# Altium schematic sheet Control_Test_Board.SchDoc: Control Test Board - Logic
size A4; Author: Dev Patel; Organization: Waterloop; Address1: 200 University Ave W; Address2: Engineering 5, 1104; Address3: Waterloo, ON; Address4: N2L 3G1; Revision: 1.0; SheetNumber: 1; SheetTotal: 2
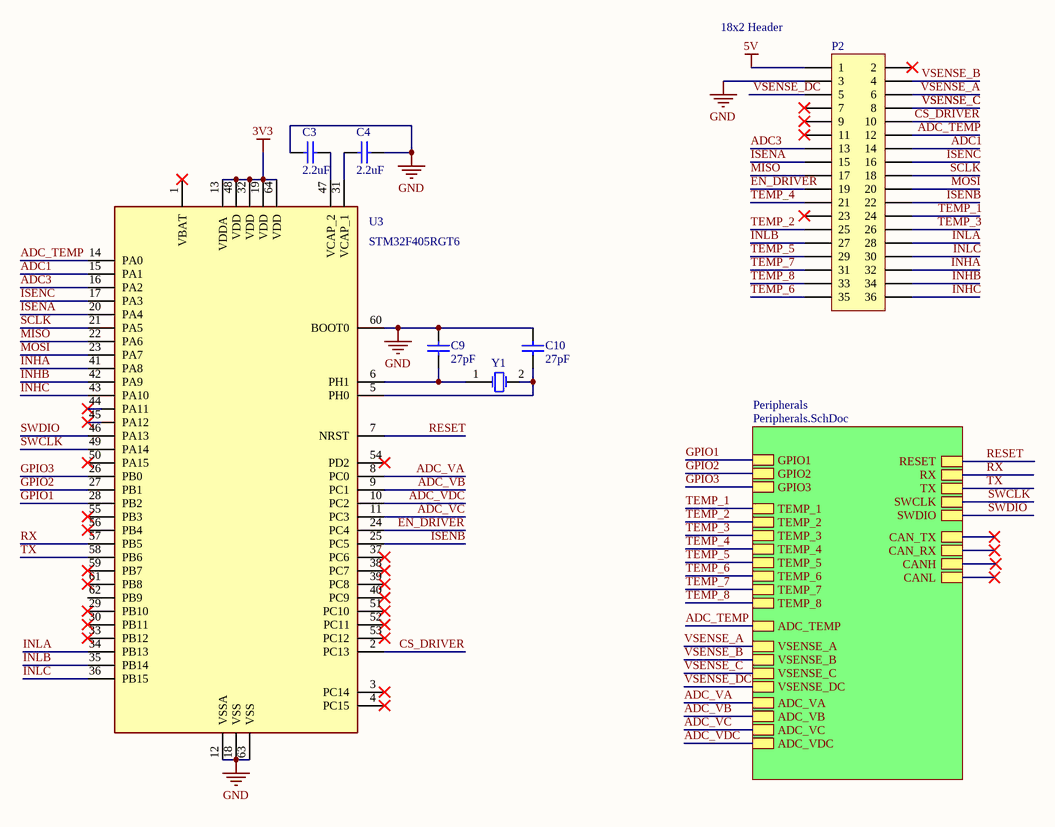
[diagram p0: Control_Test_Board.SchDoc]

## Parts
C3  value 2.2uF  [0805 - Capacitor]  (hidden comment: Capacitor - Nonpolarized)
C4  value 2.2uF  [0805 - Capacitor]  (hidden comment: Capacitor - Nonpolarized)
C9  value 27pF  [0805 - Capacitor]  (hidden comment: 100V)
C10  value 27pF  [0805 - Capacitor]  (hidden comment: 100V)
P2  Header 18X2  [HDR2X18]  (value not drawn)
U3  STM32F405RGT6  [STM32F405RG]
Y1  Oscillator  [2-SMD NO LEAD CRSYSTAL]  (value not drawn)

## Sub-sheets
Peripherals = Peripherals.SchDoc: GPIO1, GPIO2, GPIO3, TEMP_1, TEMP_2, TEMP_3, TEMP_4, TEMP_5, TEMP_6, TEMP_7, TEMP_8, ADC_TEMP, VSENSE_A, VSENSE_B, VSENSE_C, VSENSE_DC, ADC_VA, ADC_VB, ADC_VC, ADC_VDC, RESET, RX, TX, SWCLK, SWDIO, CAN_TX, CAN_RX, CANH, CANL

## Nets
3V3: U3.13(VDDA) U3.19(VDD) U3.32(VDD) U3.48(VDD) U3.64(VDD)
5V: P2.1
GND: C3.1 C4.2 C9.2 C10.2 P2.3 U3.12(VSSA) U3.18(VSS) U3.60(BOOT0) U3.63(VSS)
ADC1: P2.14 U3.15(PA1)
ADC3: P2.13 U3.16(PA2)
ADC_TEMP: P2.12 U3.14(PA0) ; sheet Peripherals/ADC_TEMP
ADC_VA: U3.8(PC0) ; sheet Peripherals/ADC_VA
ADC_VB: U3.9(PC1) ; sheet Peripherals/ADC_VB
ADC_VC: U3.11(PC3) ; sheet Peripherals/ADC_VC
ADC_VDC: U3.10(PC2) ; sheet Peripherals/ADC_VDC
CS_DRIVER: P2.10 U3.2(PC13)
EN_DRIVER: P2.19 U3.24(PC4)
GPIO1: U3.28(PB2) ; sheet Peripherals/GPIO1
GPIO2: U3.27(PB1) ; sheet Peripherals/GPIO2
GPIO3: U3.26(PB0) ; sheet Peripherals/GPIO3
INHA: P2.32 U3.41(PA8)
INHB: P2.34 U3.42(PA9)
INHC: P2.36 U3.43(PA10)
INLA: P2.28 U3.34(PB13)
INLB: P2.27 U3.35(PB14)
INLC: P2.30 U3.36(PB15)
ISENA: P2.15 U3.20(PA4)
ISENB: P2.22 U3.25(PC5)
ISENC: P2.16 U3.17(PA3)
MISO: P2.17 U3.22(PA6)
MOSI: P2.20 U3.23(PA7)
RESET: U3.7(NRST) ; sheet Peripherals/RESET
RX: U3.57(PB5) ; sheet Peripherals/RX
SCLK: P2.18 U3.21(PA5)
SWCLK: U3.49(PA14) ; sheet Peripherals/SWCLK
SWDIO: U3.46(PA13) ; sheet Peripherals/SWDIO
TEMP_1: P2.24 ; sheet Peripherals/TEMP_1
TEMP_2: P2.25 ; sheet Peripherals/TEMP_2
TEMP_3: P2.26 ; sheet Peripherals/TEMP_3
TEMP_4: P2.21 ; sheet Peripherals/TEMP_4
TEMP_5: P2.29 ; sheet Peripherals/TEMP_5
TEMP_6: P2.35 ; sheet Peripherals/TEMP_6
TEMP_7: P2.31 ; sheet Peripherals/TEMP_7
TEMP_8: P2.33 ; sheet Peripherals/TEMP_8
TX: U3.58(PB6) ; sheet Peripherals/TX
VSENSE_A: P2.6 ; sheet Peripherals/VSENSE_A
VSENSE_B: P2.4 ; sheet Peripherals/VSENSE_B
VSENSE_C: P2.8 ; sheet Peripherals/VSENSE_C
VSENSE_DC: P2.5 ; sheet Peripherals/VSENSE_DC
NetC3_2: C3.2 U3.47(VCAP_2)
NetC4_1: C4.1 U3.31(VCAP_1)
NetC9_1: C9.1 U3.6(PH1) Y1.1(OSC1)
NetC10_1: C10.1 U3.5(PH0) Y1.2(OSC2)

Not connected (* = marked no-connect by the designer): P2 2* 7* 9* 11* 23*; U3 1(VBAT)* 3(PC14)* 4(PC15)* 29(PB10)* 30(PB11)* 33(PB12)* 37(PC6)* 38(PC7)* 39(PC8)* 40(PC9)* 44(PA11)* 45(PA12)* 50(PA15)* 51(PC10)* 52(PC11)* 53(PC12)* 54(PD2)* 55(PB3)* 56(PB4)* 59(PB7)* 61(PB8)* 62(PB9)

## Notes on the sheet
- 18x2 Header
- Title:
- Size:
- Date:
- A4
- Author:
- Revision:
- Sheet
- of
- File:

## Library data of the parts
C3 C4 C9 C10 = Capacitor - Nonpolarized: Nonpolarized Capacitor; Supplier: *; Manufacturer: *; Rating: *; Manufacturer Part Number: *
  C3 C4: Supplier Part Number: 311-3420-1-ND
  C9 C10: Supplier Part Number: 311-1104-1-ND
P2 = Header 18X2: Header, 18-Pin, Dual row; LatestRevisionDate: 17-Jul-2002; LatestRevisionNote: Re-released for DXP Platform.; Publisher: Altium Limited
U3 = STM32F405RGT6: ST 64-pin Micro; Manufacturer Part Number: STM32F405RG; Manufacturer: ST; Supplier Part Number: 497-11767-ND; Supplier: Digikey; ComponentLink1Description: Datsheet; ComponentLink1URL: https://www.st.com/content/ccc/resource/technical/document/datasheet/ef/92/76/6d/bb/c2/4f/f7/DM00037051.pdf/files/DM00037051.pdf/jcr:content/translations/en.DM00037051.pdf
Y1 = Oscillator: Crystal Oscillator; Value: 16MHz; Manufacturer Part Number: *; Manufacturer: *; Supplier Part Number: 535-13460-1-ND; Supplier: *; Rating: *